# EasyEDA Pro project MicroMouse_v02.eprj, schematic Schematic1

## Sheets
1 Overview: Board Name: Board1; Create Date: 2024-06-04; Page Name: Overview; Project Name: MicroMouse_v01; Schematic Name: Schematic1; Update Date: 2024-10-15; Company: FH-Hagenberg; Drawn: Viktor Hofer; Page Size: A3; Version: V0.1
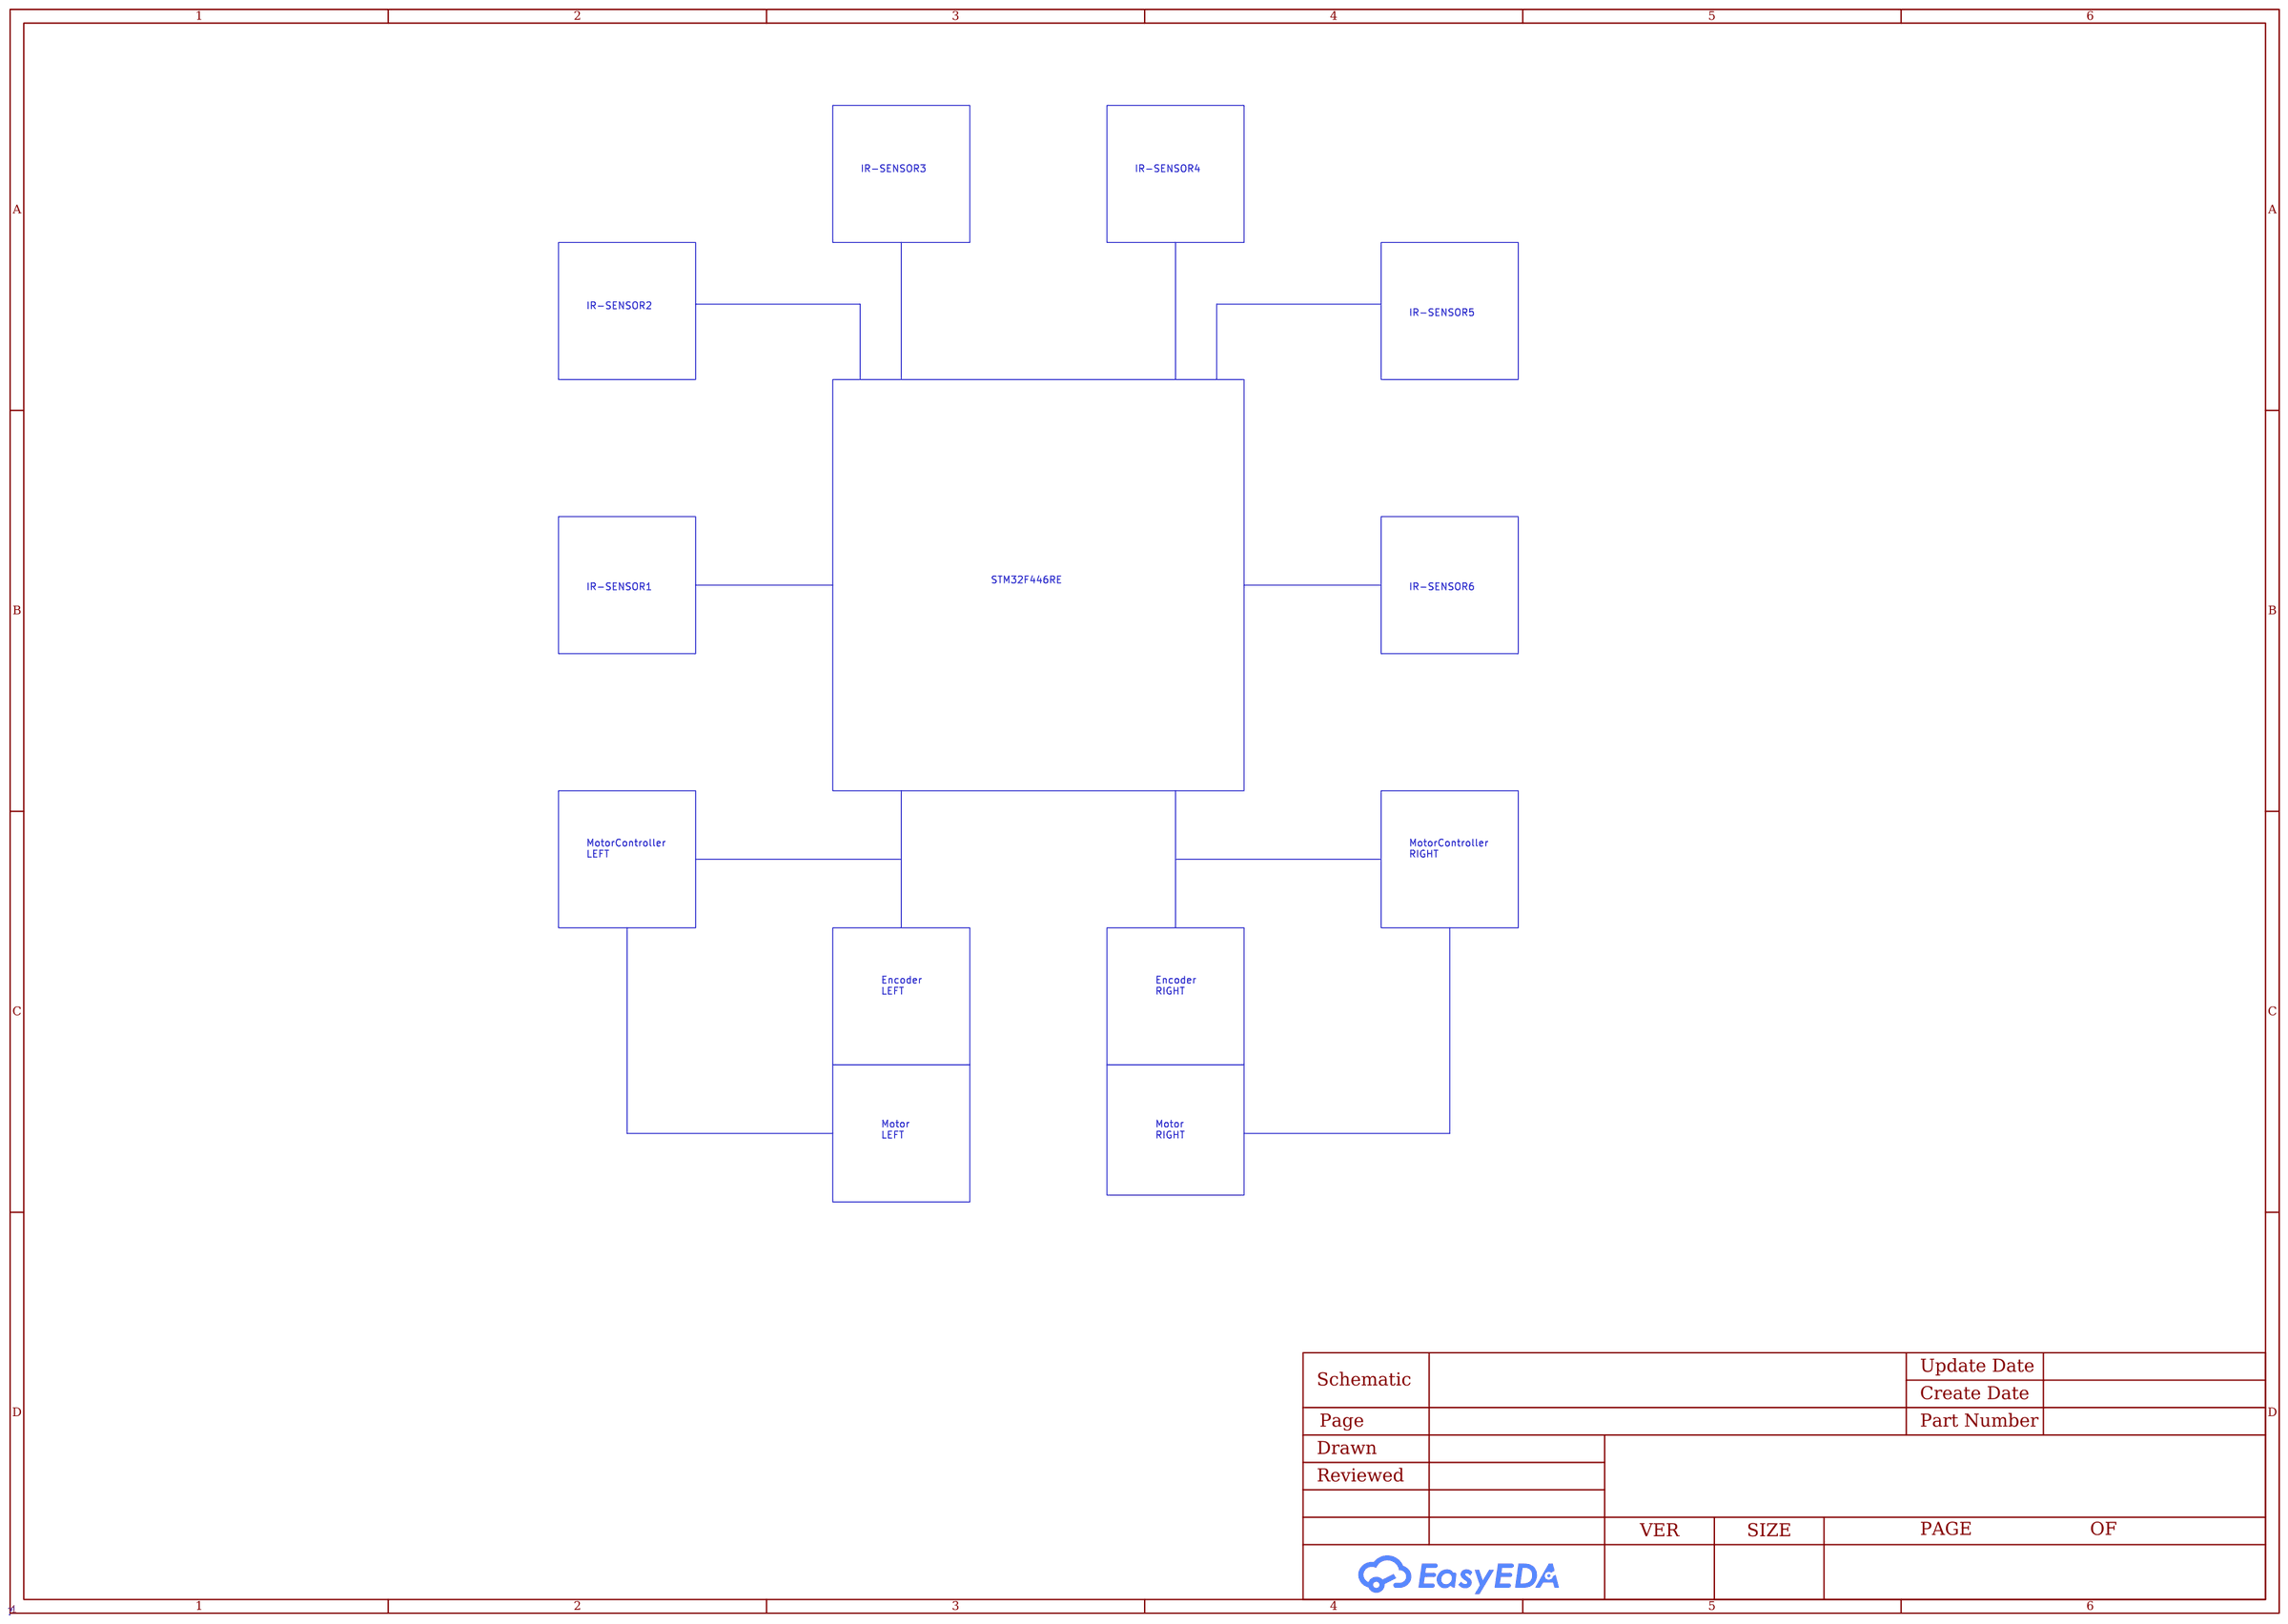
[diagram p0: Overview]
2 VCC: Create Date: 2024-11-02; Page Name: VCC; Project Name: MicroMouse_v02; Update Date: 2024-11-02
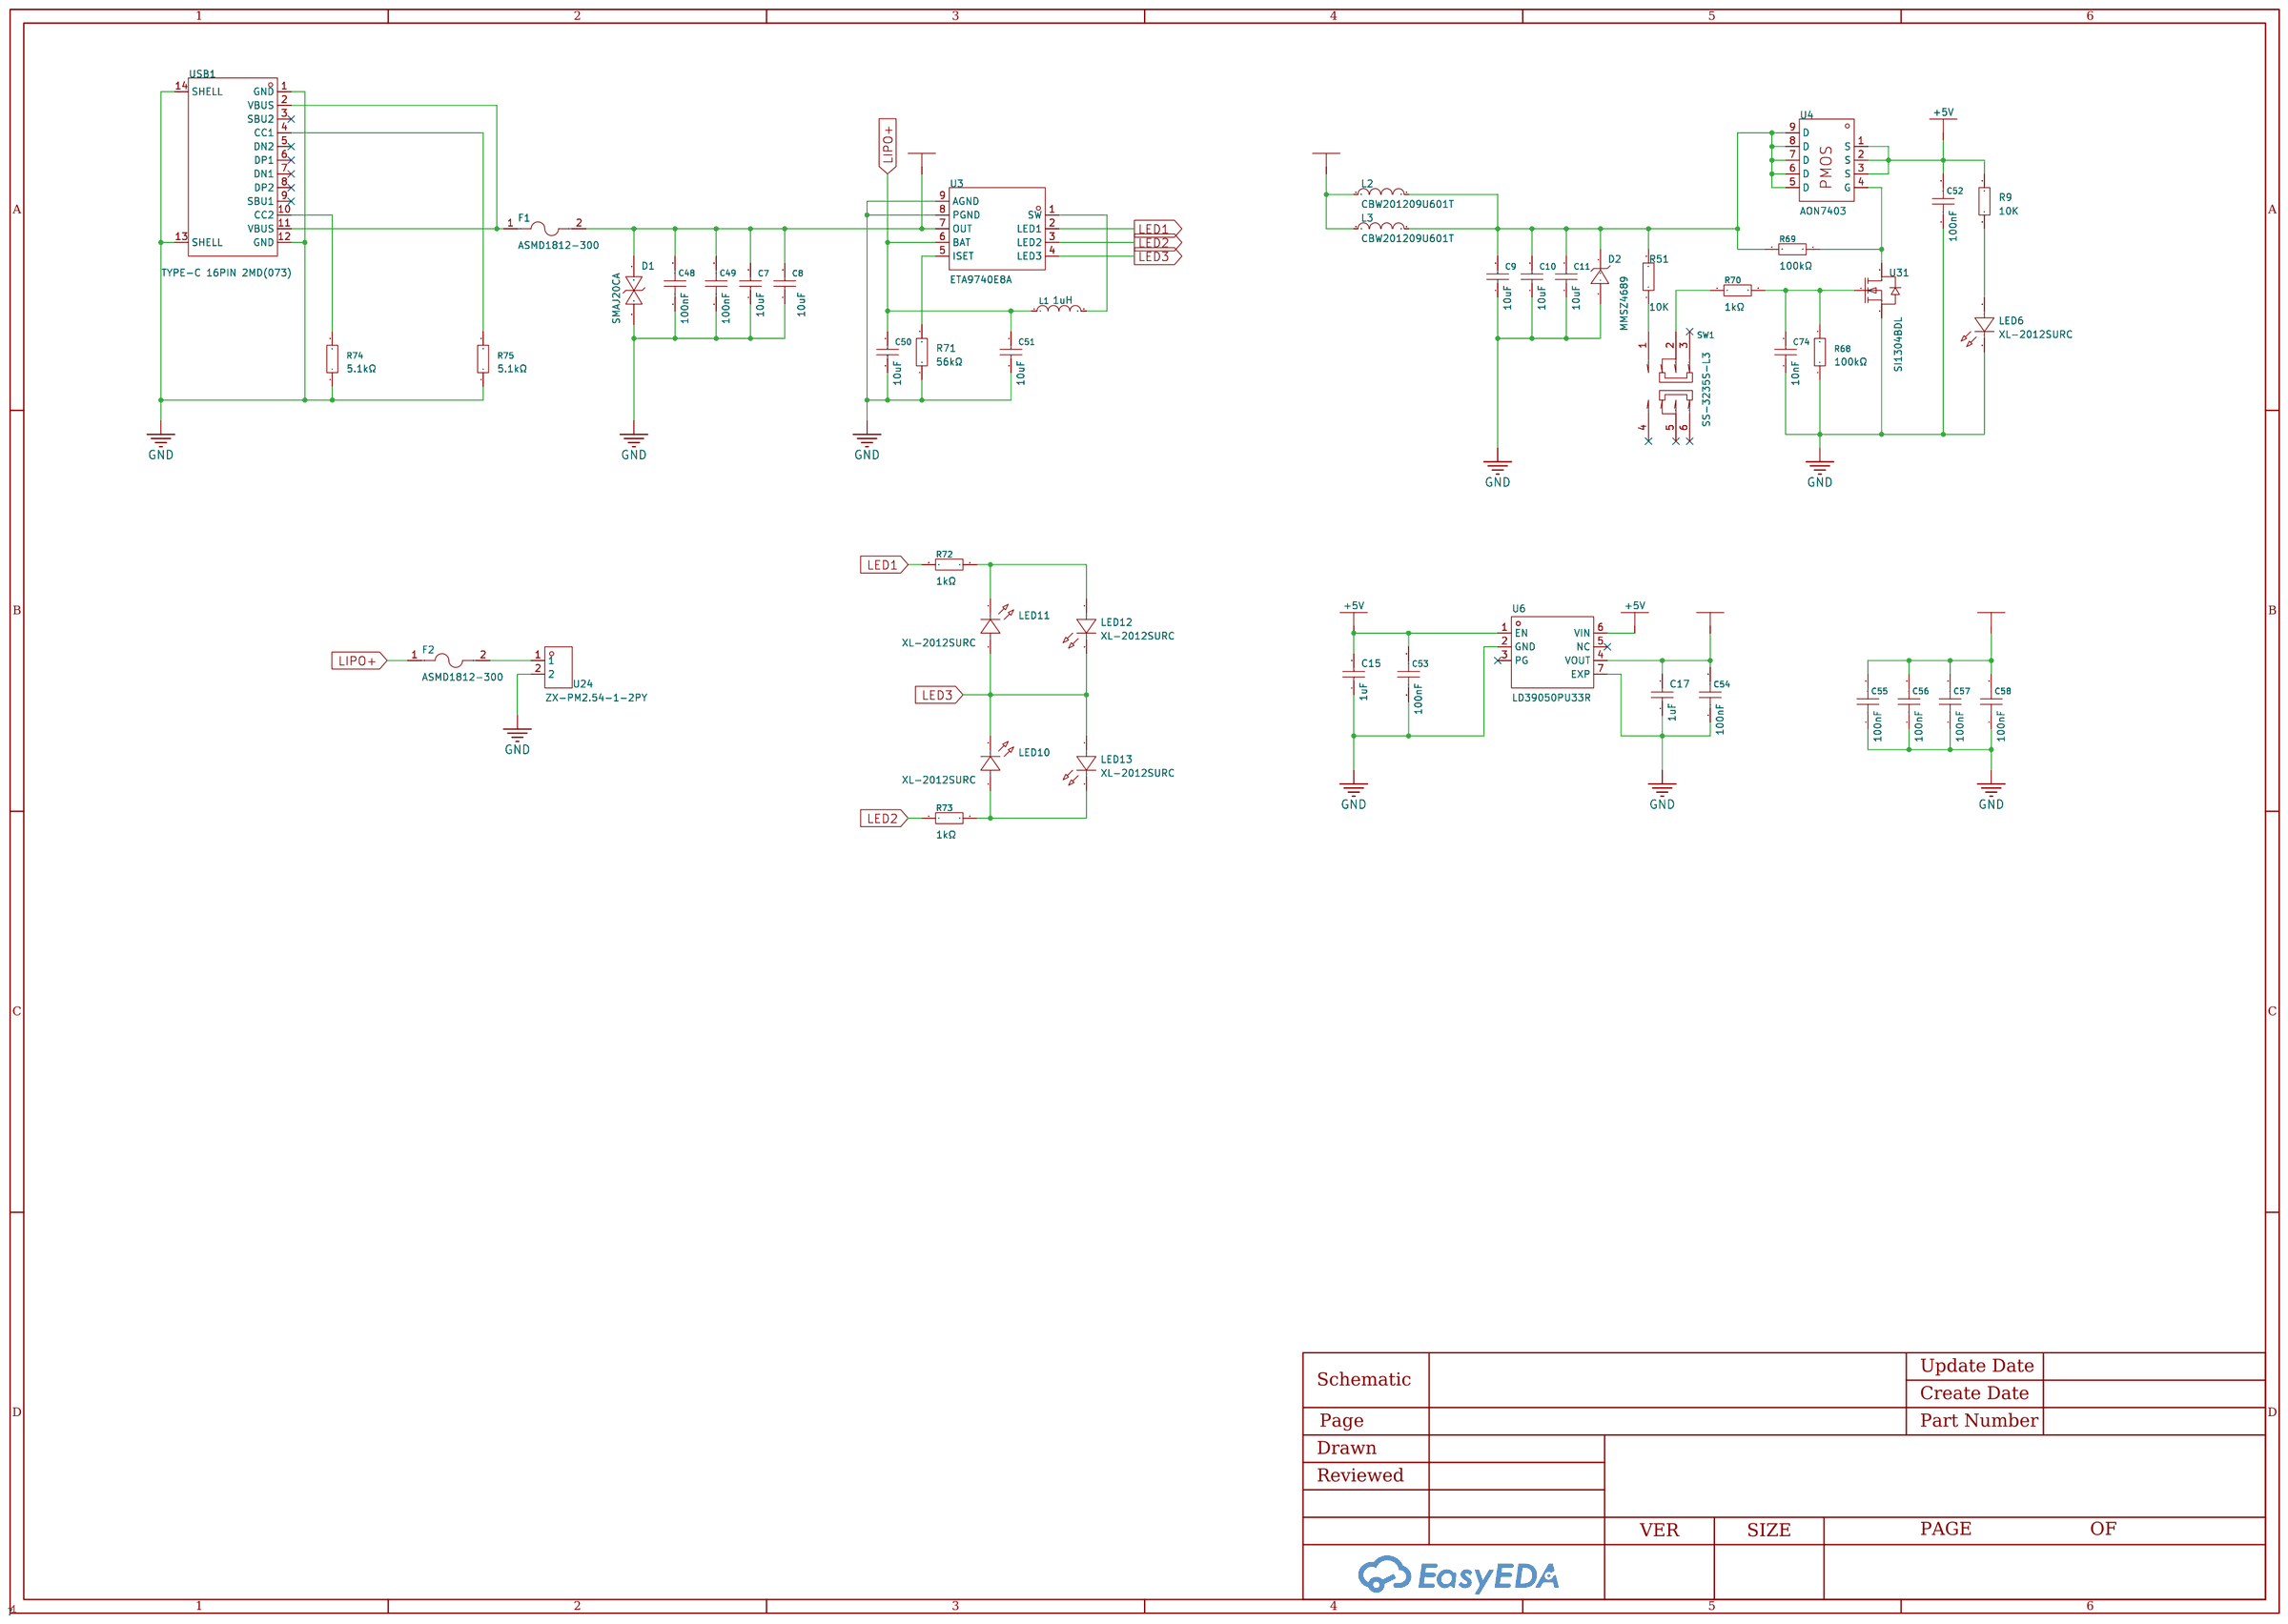
[diagram p1: VCC]
3 Controller: Create Date: 2024-11-02; Page Name: Controller; Project Name: MicroMouse_v02; Update Date: 2024-11-12
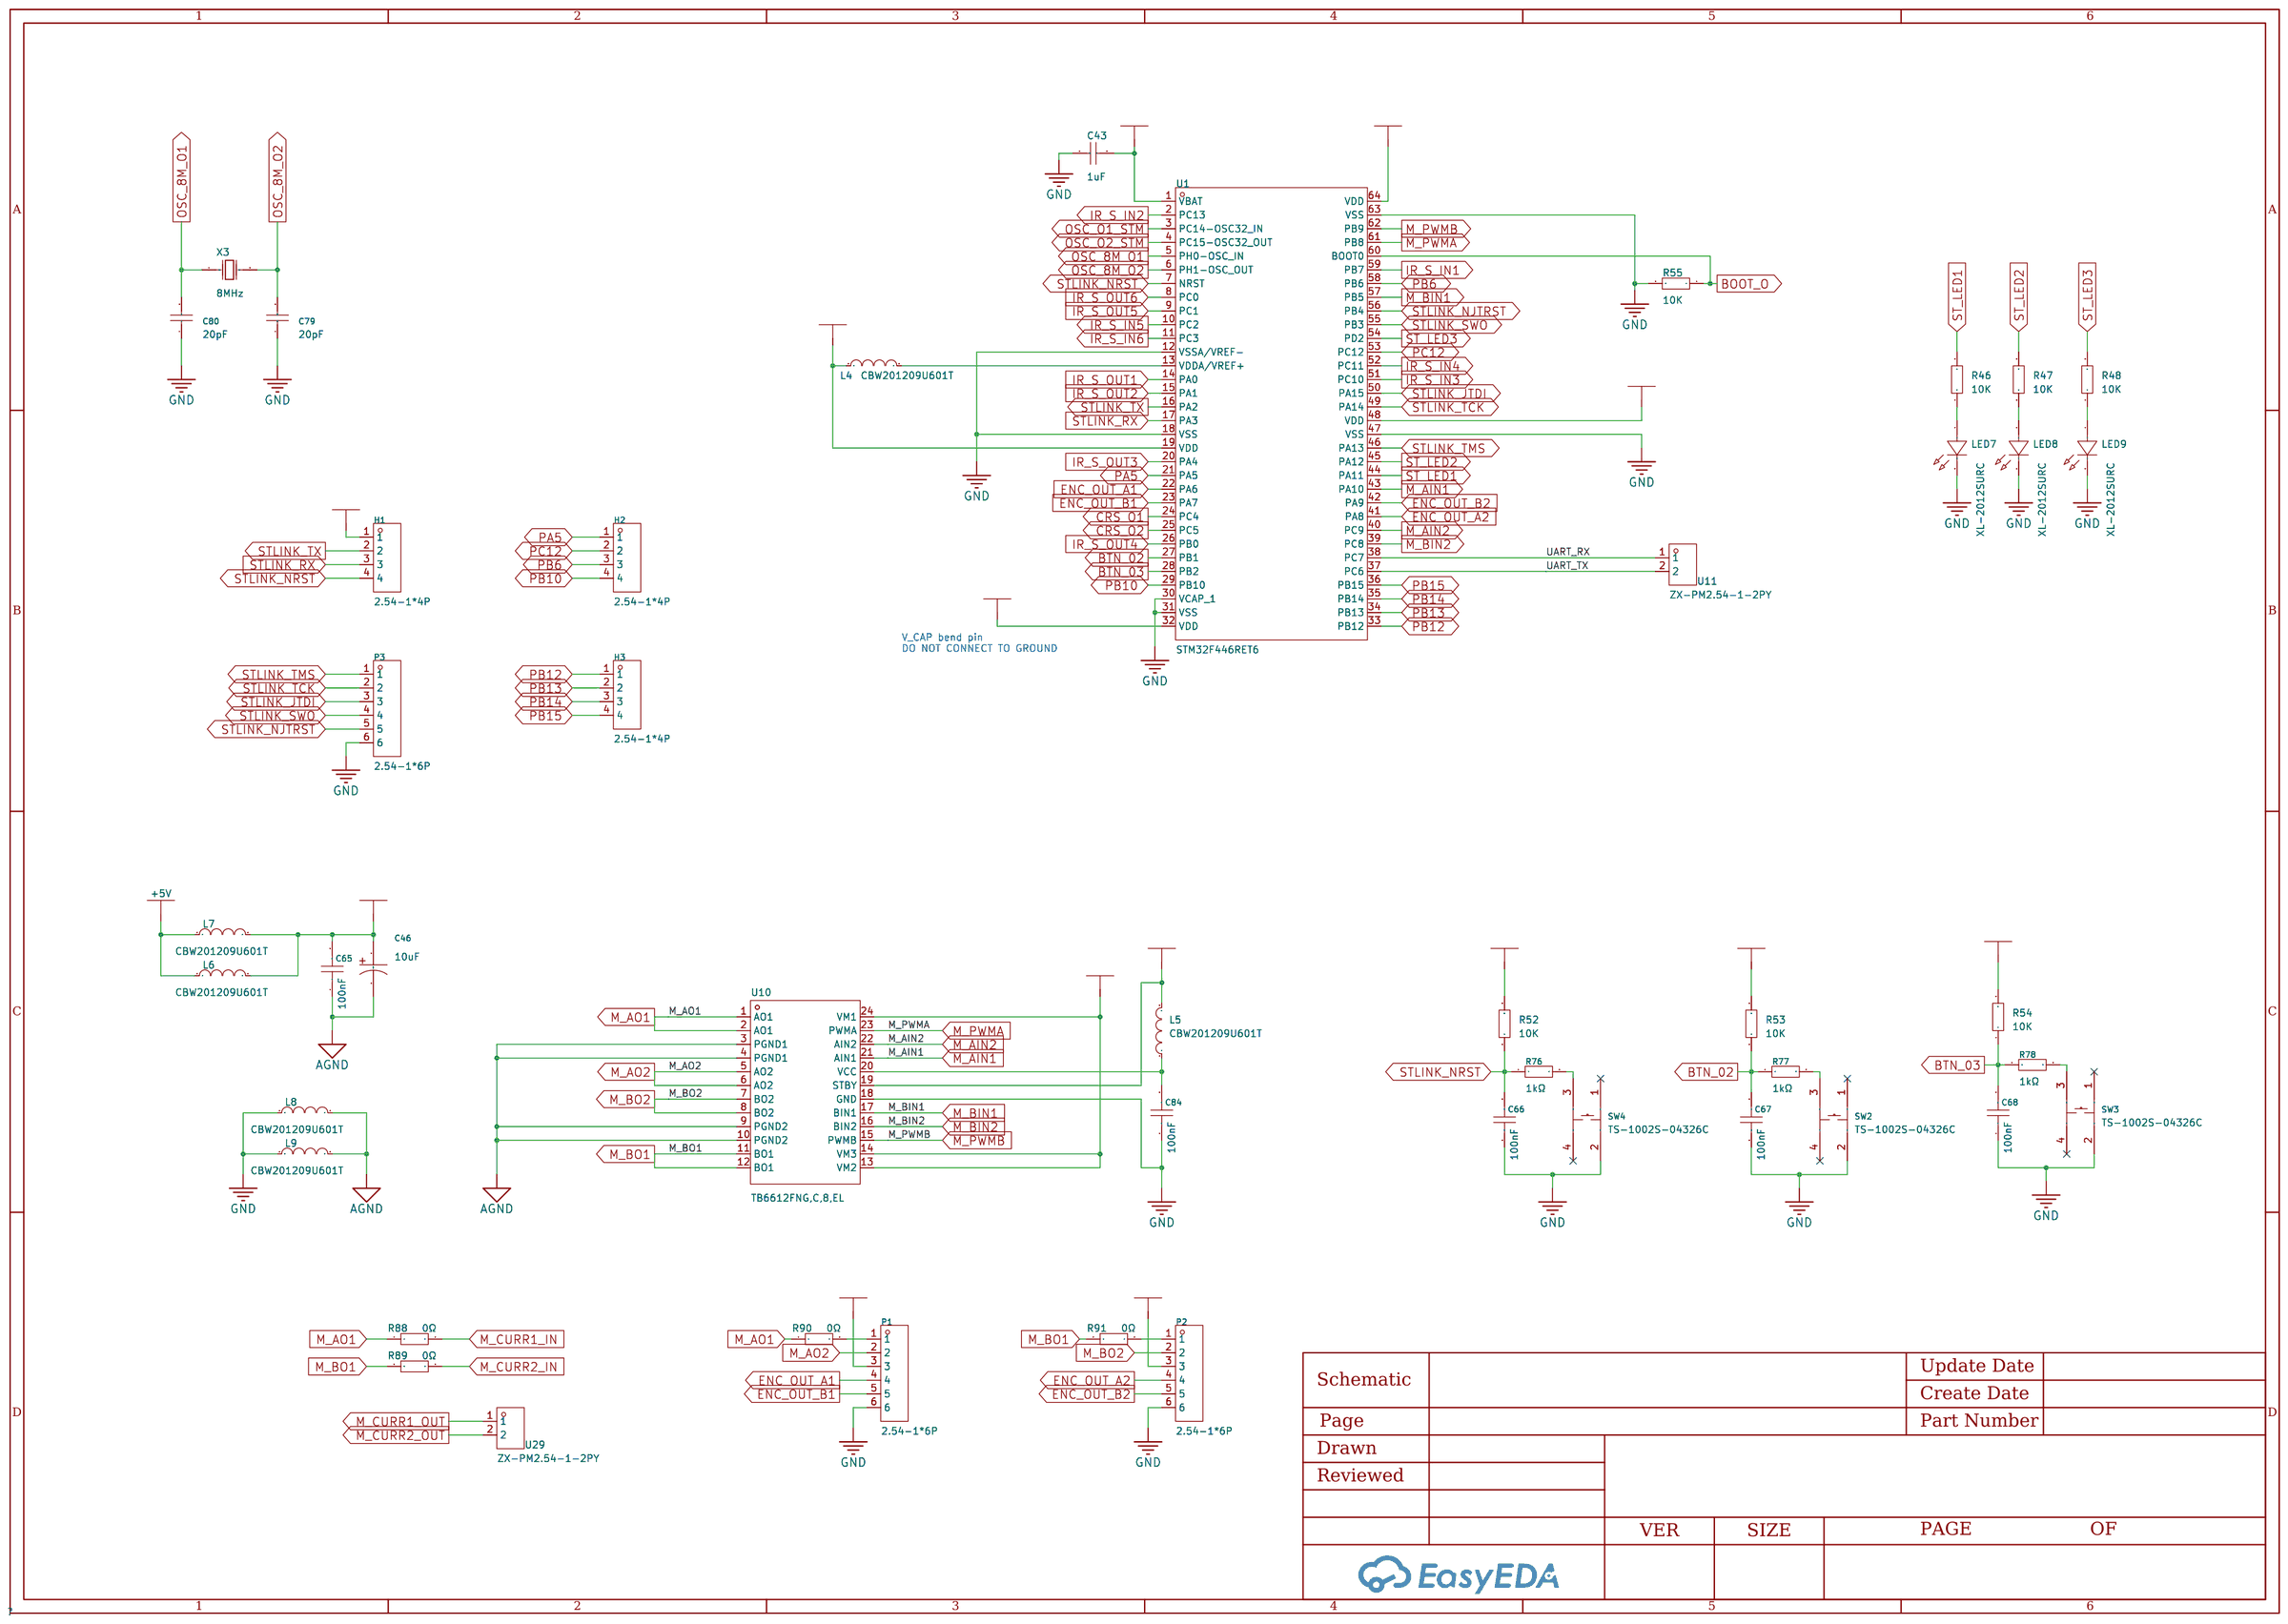
[diagram p2: Controller]
4 Sensors: Create Date: 2024-11-02; Page Name: Sensors; Project Name: MicroMouse_v02; Update Date: 2024-11-02
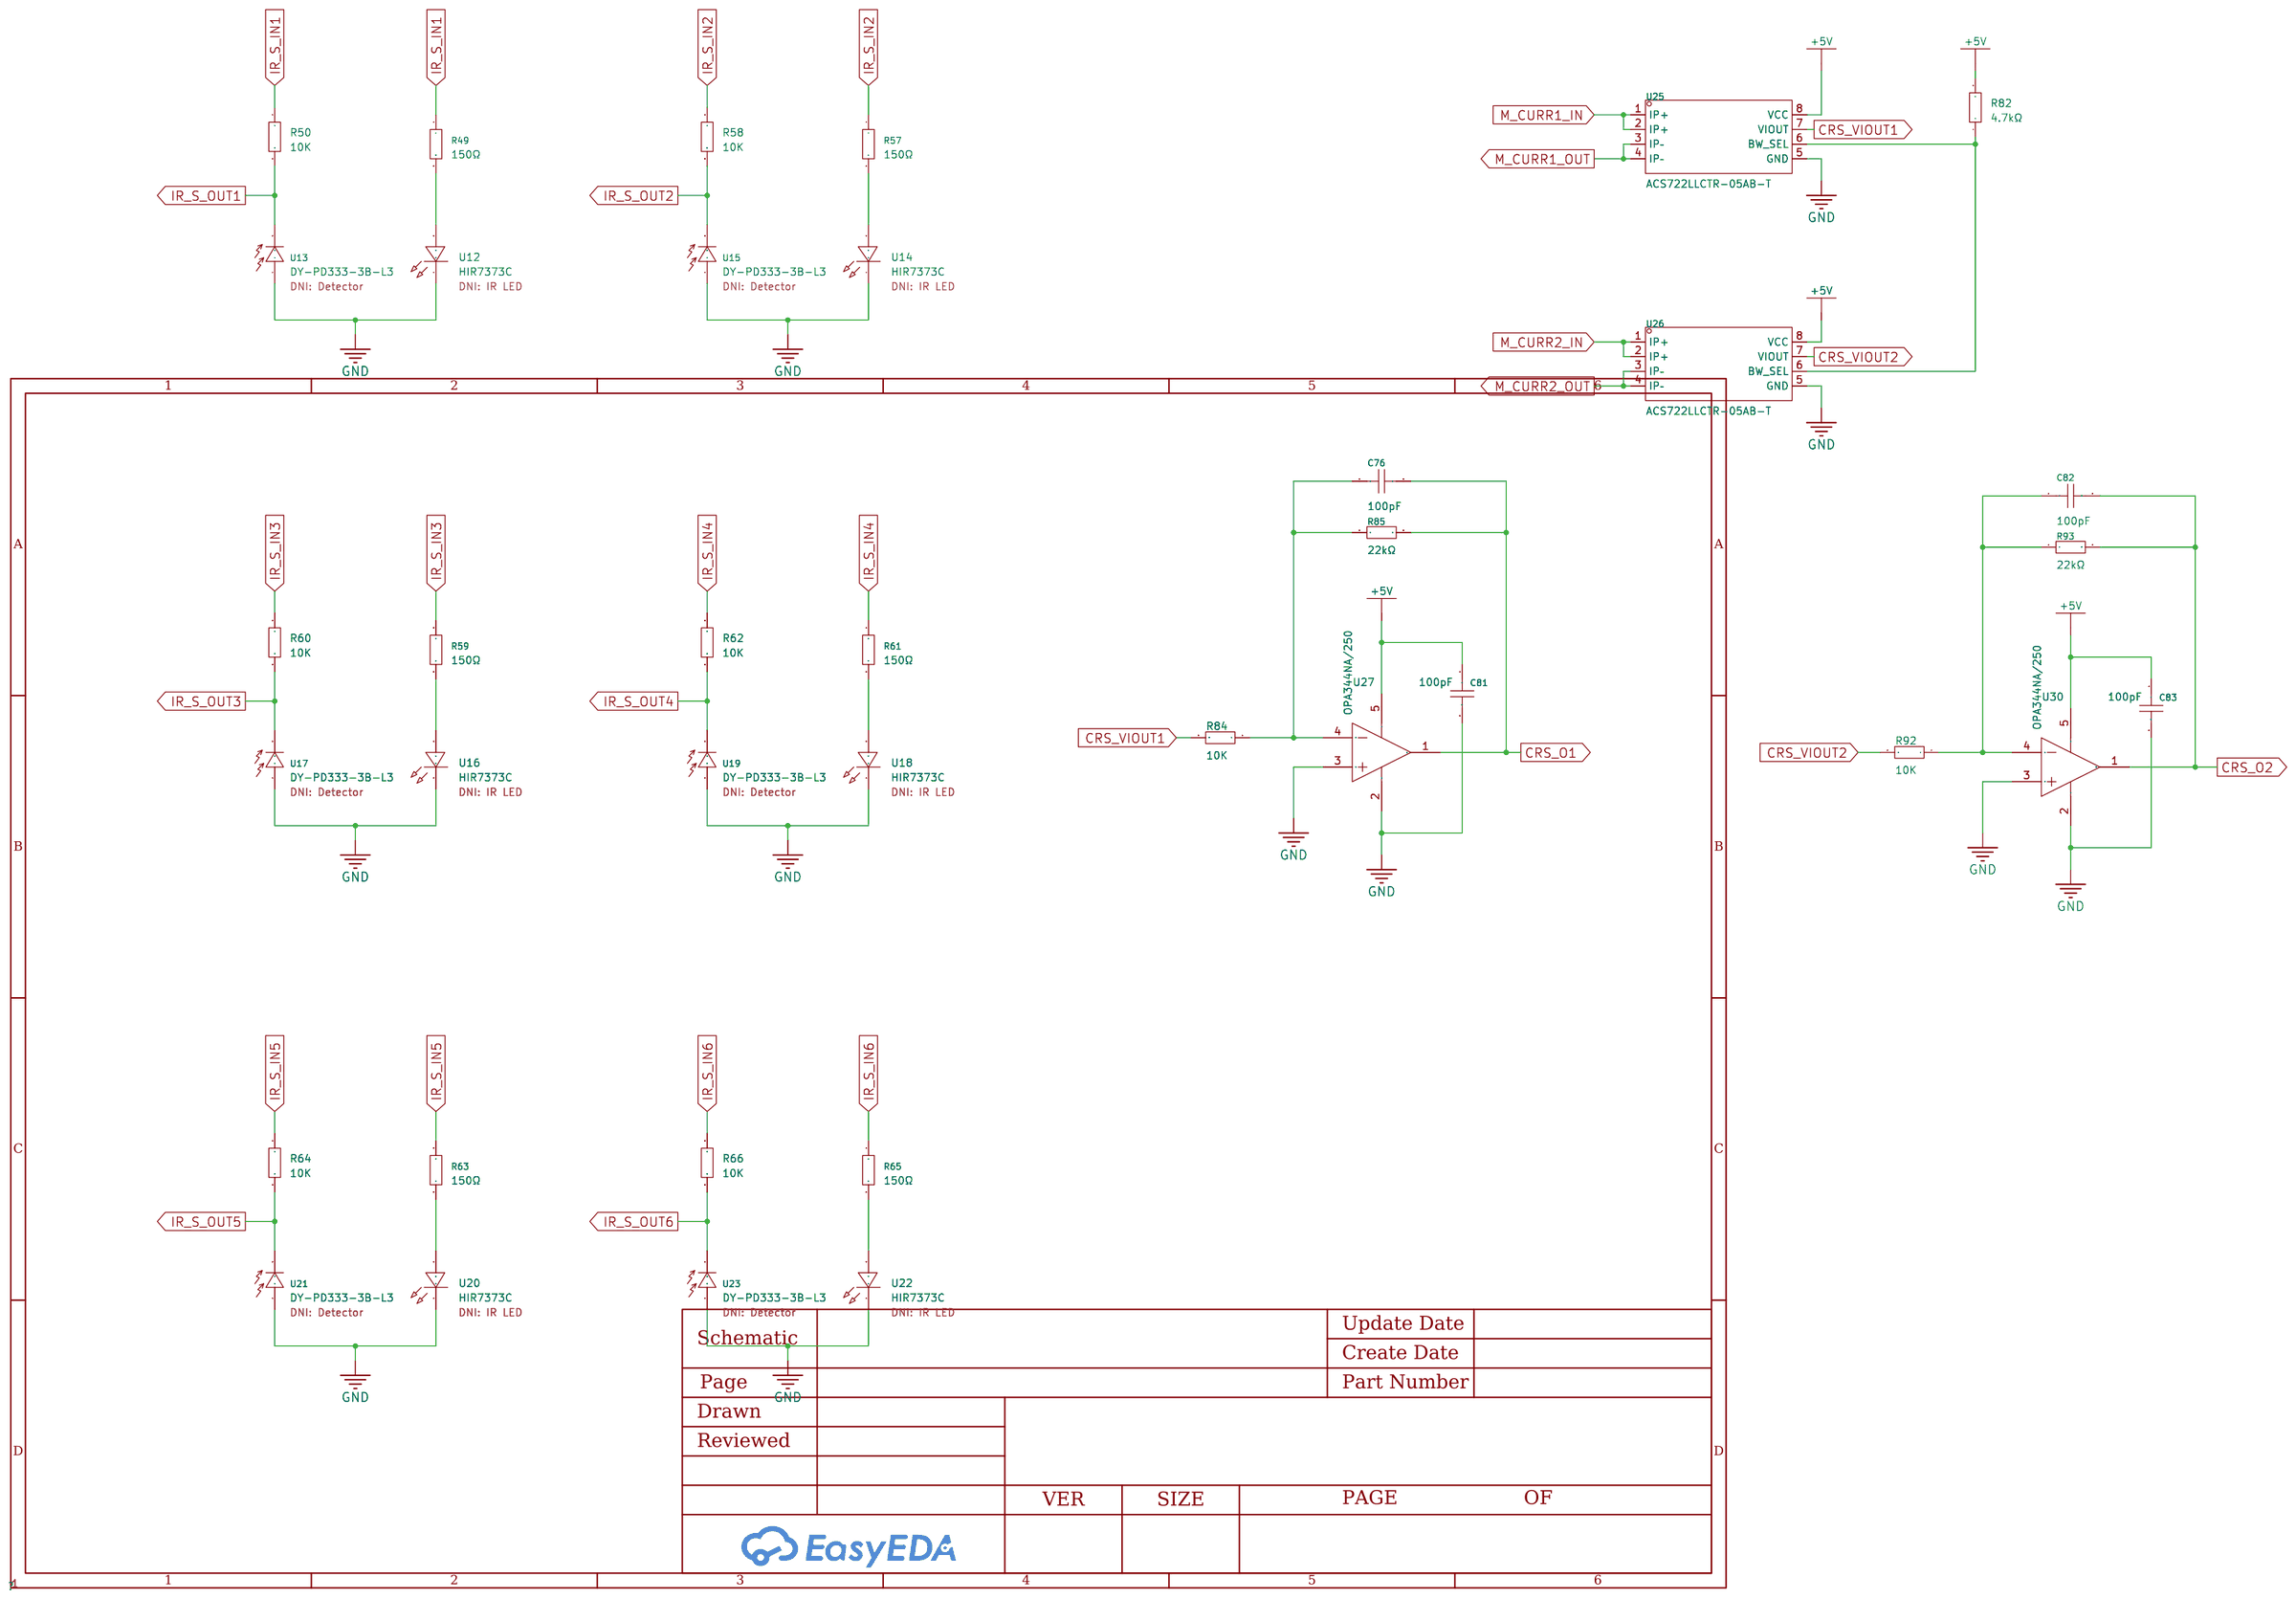
[diagram p3: Sensors]

## Parts
sheet Controller
C43  1uF  [C0603]
C46  10uF  [CAP-TH_BD5.0-P5.00-D1.0-FD]
C65  100nF  [C0603]
C66  100nF  [C0603]
C67  100nF  [C0603]
C68  100nF  [C0603]
C79  20pF  [C0603]
C80  20pF  [C0603]
C84  100nF  [C0603]
H1  2.54-1*4P  [HDR-TH_4P-P2.54-V-F]
H2  2.54-1*4P  [HDR-TH_4P-P2.54-V-F]
H3  2.54-1*4P  [HDR-TH_4P-P2.54-V-F]
L4  CBW201209U601T  [L0805]
L5  CBW201209U601T  [L0805]
L6  CBW201209U601T  [L0805]
L7  CBW201209U601T  [L0805]
L8  CBW201209U601T  [L0805]
L9  CBW201209U601T  [L0805]
LED7  XL-2012SURC  [LED0805-R-RD]
LED8  XL-2012SURC  [LED0805-R-RD]
LED9  XL-2012SURC  [LED0805-R-RD]
P1  2.54-1*6P  [HDR-TH_6P-P2.54-V-F]
P2  2.54-1*6P  [HDR-TH_6P-P2.54-V-F]
P3  2.54-1*6P  [HDR-TH_6P-P2.54-V-F]
R46  10K  [R0603]
R47  10K  [R0603]
R48  10K  [R0603]
R52  10K  [R0603]
R53  10K  [R0603]
R54  10K  [R0603]
R55  10K  [R0603]
R76  1kΩ  [R0603]
R77  1kΩ  [R0603]
R78  1kΩ  [R0603]
R88  0Ω  [R0603]
R89  0Ω  [R0603]
R90  0Ω  [R0603]
R91  0Ω  [R0603]
SW2  TS-1002S-04326C  [KEY-SMD_4P-L6.0-W6.0-P4.50-LS9.0]
SW3  TS-1002S-04326C  [KEY-SMD_4P-L6.0-W6.0-P4.50-LS9.0]
SW4  TS-1002S-04326C  [KEY-SMD_4P-L6.0-W6.0-P4.50-LS9.0]
U1  STM32F446RET6  [LQFP-64_L10.0-W10.0-P0.50-LS12.0-BL]
U10  TB6612FNG,C,8,EL  [SSOP-24_L8.3-W5.6-P0.65-LS7.6-BL]
U11  ZX-PM2.54-1-2PY  [HDR-TH_2P-P2.54-V-F]
U29  ZX-PM2.54-1-2PY  [HDR-TH_2P-P2.54-V-F]
X3  8MHz  [CRYSTAL-SMD_L11.5-W4.8-LS12.7]
sheet Sensors
C76  100pF  [C0603]
C81  100pF  [C0603]
C82  100pF  [C0603]
C83  100pF  [C0603]
R49  150Ω  [R0603]
R50  10K  [R0603]
R57  150Ω  [R0603]
R58  10K  [R0603]
R59  150Ω  [R0603]
R60  10K  [R0603]
R61  150Ω  [R0603]
R62  10K  [R0603]
R63  150Ω  [R0603]
R64  10K  [R0603]
R65  150Ω  [R0603]
R66  10K  [R0603]
R82  4.7kΩ  [R0603]
R84  10K  [R0603]
R85  22kΩ  [R0603]
R92  10K  [R0603]
R93  22kΩ  [R0603]
U12  HIR7373C  [LED-TH_BD5.0-P2.54-L-RD]
U13  DY-PD333-3B-L3  [LED-TH_BD5.0-P2.54-FD]
U14  HIR7373C  [LED-TH_BD5.0-P2.54-L-RD]
U15  DY-PD333-3B-L3  [LED-TH_BD5.0-P2.54-FD]
U16  HIR7373C  [LED-TH_BD5.0-P2.54-L-RD]
U17  DY-PD333-3B-L3  [LED-TH_BD5.0-P2.54-FD]
U18  HIR7373C  [LED-TH_BD5.0-P2.54-L-RD]
U19  DY-PD333-3B-L3  [LED-TH_BD5.0-P2.54-FD]
U20  HIR7373C  [LED-TH_BD5.0-P2.54-L-RD]
U21  DY-PD333-3B-L3  [LED-TH_BD5.0-P2.54-FD]
U22  HIR7373C  [LED-TH_BD5.0-P2.54-L-RD]
U23  DY-PD333-3B-L3  [LED-TH_BD5.0-P2.54-FD]
U25  ACS722LLCTR-05AB-T  [SOIC-8_L4.9-W3.9-P1.27-LS6.0-BL]
U26  ACS722LLCTR-05AB-T  [SOIC-8_L4.9-W3.9-P1.27-LS6.0-BL]
U27  OPA344NA/250  [SOT-23-5_L3.0-W1.7-P0.95-LS2.8-BR]
U30  OPA344NA/250  [SOT-23-5_L3.0-W1.7-P0.95-LS2.8-BR]
sheet VCC
C7  10uF  [C0805]
C8  10uF  [C0805]
C9  10uF  [C0805]
C10  10uF  [C0805]
C11  10uF  [C0805]
C15  1uF  [C0603]
C17  1uF  [C0603]
C48  100nF  [C0603]
C49  100nF  [C0603]
C50  10uF  [C0805]
C51  10uF  [C0805]
C52  100nF  [C0603]
C53  100nF  [C0603]
C54  100nF  [C0603]
C55  100nF  [C0603]
C56  100nF  [C0603]
C57  100nF  [C0603]
C58  100nF  [C0603]
C74  10nF  [C0603]
D1  SMAJ20CA  [SMA_L4.3-W2.6-LS5.2-BI]
D2  MMSZ4689  [SOD-123_L2.8-W1.8-LS3.7-RD]
F1  ASMD1812-300  [F1812]
F2  ASMD1812-300  [F1812]
L1  1uH  [IND-SMD_L7.2-W6.6_GPSR0730]
L2  CBW201209U601T  [L0805]
L3  CBW201209U601T  [L0805]
LED6  XL-2012SURC  [LED0805-R-RD]
LED10  XL-2012SURC  [LED0805-R-RD]
LED11  XL-2012SURC  [LED0805-R-RD]
LED12  XL-2012SURC  [LED0805-R-RD]
LED13  XL-2012SURC  [LED0805-R-RD]
R9  10K  [R0603]
R51  10K  [R0603]
R68  100kΩ  [R0603]
R69  100kΩ  [R0603]
R70  1kΩ  [R0603]
R71  56kΩ  [R0603]
R72  1kΩ  [R0603]
R73  1kΩ  [R0603]
R74  5.1kΩ  [R0603]
R75  5.1kΩ  [R0603]
SW1  SS-3235S-L3  [SW-SMD_SS-3235S-L3.00]
U3  ETA9740E8A  [ESOP-8_L4.9-W3.9-P1.27-LS6.0-BL-EP-1]
U4  AON7403  [DFN-8_L3.0-W3.0-P0.65-BL]
U6  LD39050PU33R  [DFN-6_L3.0-W3.0-P0.95-LS3.1-TL-EP]
U24  ZX-PM2.54-1-2PY  [HDR-TH_2P-P2.54-V-F]
U31  SI1304BDL  [SOT-323-3_L2.0-W1.3-P1.30-LS2.1-BL]
USB1  TYPE-C 16PIN 2MD(073)  [USB-C-SMD_TYPE-C-6PIN-2MD-073]

## Library data of the parts
C15 C17 C43 = CL10A105KO8NNNC: Capacitance: Tolerance:±10% Tolerance:±10% Voltage Rated: Temperature Coefficient:; LCSC Part Name: 1uF ±10% 16V; Supplier Part: C1592; Manufacturer: SAMSUNG(三星); Supplier Footprint: 0603; JLCPCB Part Class: Extended Part; Datasheet: https://atta.szlcsc.com/upload/public/pdf/source/20220919/9FBE606BE0D9532D730F292EB26DC5BB.pdf; Supplier: LCSC; Tolerance: ±10%
C46 = UVZ1C100MDD1TA: Capacitance: Tolerance:±20% Tolerance:±20% Rated Voltage: Ripple Current:35mA@120Hz Equivalent Series Resistance(ESR):- Lead Spacing:2mm φD: L: Lifetime @ Temp:1000hrs@105℃ Operating Temperature:-55℃~+105℃ Operating Temperature:-55℃~+105℃; LCSC Part Name: 10uF ±20% 16V; Supplier Part: C250876; Manufacturer: Nichicon(尼吉康); Supplier Footprint: 插件,D5xL11mm; JLCPCB Part Class: Extended Part; Datasheet: https://atta.szlcsc.com/upload/public/pdf/source/20180925/C308870_1835EFB626D2D8CF3B207CFFD6F8F272.pdf; Supplier: LCSC; Tolerance: ±20%; Ripple Current: 35mA@120Hz; Lead Spacing: 2mm; Lifetime @ Temp: 1000hrs@105℃; Operating Temperature: -55℃~+105℃
C48 C49 C52-C58 C65-C68 C84 = CC0603KRX7R6BB104: Capacitance: Tolerance:±10% Tolerance:±10% Voltage Rated: Temperature Coefficient:; LCSC Part Name: 100nF ±10% 10V; Supplier Part: C519438; Manufacturer: YAGEO(国巨); Supplier Footprint: 0603; JLCPCB Part Class: Extended Part; Datasheet: https://atta.szlcsc.com/upload/public/pdf/source/20200423/C519438_5D8E3909BA347820A92655F61B0D4FC7.pdf; Supplier: LCSC; Tolerance: ±10%
C79 C80 = CC0603JRNPO9BN200: Capacitance: Tolerance:±5% Tolerance:±5% Voltage Rated: Temperature Coefficient:; LCSC Part Name: 20pF ±5% 50V; Supplier Part: C105621; Manufacturer: YAGEO(国巨); Supplier Footprint: 0603; JLCPCB Part Class: Extended Part; Datasheet: https://atta.szlcsc.com/upload/public/pdf/source/20170505/1493957838062.pdf; Supplier: LCSC; Tolerance: ±5%
H1-H3 = 2.54-1*4P母: Holes Structure:1x4P Pitch:2.54mm Row Spacing:- Circular Hole / Square Hole:Square Holes Mounting Type:Straight Number of Rows:Plugin Number of Holes:4P Current Rating (Max):3A Voltage Rating (Max):- Holes Direction:Top Insulation Height:- Contact Materia; LCSC Part Name: 间距:2.54mm 1x4P 直插; Supplier Part: C2718488; Manufacturer: BOOMELE(博穆精密); Supplier Footprint: 插件,P=2.54mm; JLCPCB Part Class: Extended Part; Datasheet: https://atta.szlcsc.com/upload/public/pdf/source/20210301/C2718488_F4427B881E42CAA8DDB0B1C12B3A522C.pdf; Supplier: LCSC; Holes Structure: 1x4P; Pitch: 2.54mm; Circular Hole / Square Hole: Square Holes; Mounting Type: Straight; Number of Rows: Plugin; Number of Holes: 4P; Current Rating (Max): 3A; Holes Direction: Top; Contact Material: bronze; Operating Temperature Range: -40℃~+105℃
L2-L9 = CBW201209U601T: Impedance @ Frequency:600Ω@100MHz Tolerance:±25% Tolerance:±25% DC Resistance:250mΩ Current Rating:1.5A Circuits:1; LCSC Part Name: 单路 0805磁珠 阻抗600Ω@100MHz; Supplier Part: C21286; Manufacturer: FH(风华); Supplier Footprint: 0805; JLCPCB Part Class: Extended Part; Datasheet: https://atta.szlcsc.com/upload/public/pdf/source/20190129/C361676_507080CDC8DBC2B0B7C2139C1873642D.pdf; Supplier: LCSC; Impedance @ Frequency: 600Ω@100MHz; Tolerance: ±25%; DC Resistance: 250mΩ; Current Rating: 1.5A; Circuits: 1
LED6-LED13 = XL-2012SURC: Emitted Color:Red Power Dissipation:55mW Forward Current:25mA Dominant Wavelength:617nm~621nm Dominant Wavelength:617nm~621nm Peak Wavelength:623nm Lens Color:无色透明透镜 Color Temperature:- Color Temperature:- Viewing Angle:120° Mounting Sytle:Positive post O; Supplier Part: C965812; Manufacturer: XINGLIGHT(成兴光); Supplier Footprint: 0805; JLCPCB Part Class: Extended Part; Datasheet: https://atta.szlcsc.com/upload/public/pdf/source/20221102/49E1A0A365644091E6270AF1C5E0FE37.pdf; Supplier: LCSC; Emitted Color: Red; Power Dissipation: 55mW; Forward Current: 25mA; Dominant Wavelength: 617nm~621nm; Peak Wavelength: 623nm; Lens Color: 无色透明透镜; Viewing Angle: 120°; Mounting Sytle: Positive post; Operating Temperature: -30℃~+85℃
P1-P3 = 2.54-1*6P母: Holes Structure:1x6P Pitch:2.54mm Row Spacing:- Mounting Type:Straight Number of Rows:Plugin Number of Holes:6P Insulation Height:- Contact Material:- Contact Plating:-; LCSC Part Name: 间距:2.54mm 1x6P 直插; Supplier Part: C40877; Manufacturer: BOOMELE(博穆精密); Supplier Footprint: 插件,P=2.54mm; JLCPCB Part Class: Extended Part; Datasheet: https://atta.szlcsc.com/upload/public/pdf/source/20210301/C2718488_F4427B881E42CAA8DDB0B1C12B3A522C.pdf; Supplier: LCSC; Holes Structure: 1x6P; Pitch: 2.54mm; Mounting Type: Straight; Number of Rows: Plugin; Number of Holes: 6P
R9 R46-R48 R50-R55 R58 R60 R62 R64 R66 R84 R92 = Res_0603: DNI; Supplier Footprint: 0603
R70 R72 R73 R76-R78 = 0603WAF1001T5E: Type:Thick Film Resistors Resistance:1kΩ Tolerance:±1% Tolerance:±1% Power(Watts): Overload Voltage (Max): Temperature Coefficient:±100ppm/℃ Temperature Coefficient:±100ppm/℃ Operating Temperature Range:-55℃~+155℃ Operating Temperature Range:-55℃~+155℃; LCSC Part Name: 1kΩ ±1% 100mW 厚膜电阻; Supplier Part: C21190; Manufacturer: UNI-ROYAL(厚声); Supplier Footprint: 0603; JLCPCB Part Class: Basic Part; Datasheet: https://atta.szlcsc.com/upload/public/pdf/source/20200306/C422600_1E6D84923E4A46A82E41ADD87F860B5C.pdf; Supplier: LCSC; Type: Thick Film Resistors; Tolerance: ±1%; Temperature Coefficient: ±100ppm/℃; Operating Temperature Range: -55℃~+155℃
R88-R91 = 0603WAF0000T5E: Type:Thick Film Resistors Resistance: Tolerance:±1% Tolerance:±1% Power(Watts): Overload Voltage (Max): Operating Temperature Range:-55℃~+155℃ Operating Temperature Range:-55℃~+155℃; LCSC Part Name: 0Ω ±1% 100mW 厚膜电阻; Supplier Part: C21189; Manufacturer: UNI-ROYAL(厚声); Supplier Footprint: 0603; JLCPCB Part Class: Basic Part; Datasheet: https://atta.szlcsc.com/upload/public/pdf/source/20200306/C422600_1E6D84923E4A46A82E41ADD87F860B5C.pdf; Supplier: LCSC; Type: Thick Film Resistors; Tolerance: ±1%; Operating Temperature Range: -55℃~+155℃
SW2-SW4 = TS-1002S-04326C: Circuit:SPST Actuator Style:Round Button Mounting Style:Brick nogging Switch Length:6mm Switch Width:6mm Switch Height:4.3mm Contact Current:50mA Voltage Rating (DC):12V With Lamp:- Mechanical Life:-; LCSC Part Name: 6*6*4.3mm 立贴 轻触开关; Supplier Part: C455108; Manufacturer: XUNPU(讯普); Supplier Footprint: SMD,6x6mm; JLCPCB Part Class: Extended Part; Datasheet: https://atta.szlcsc.com/upload/public/pdf/source/20191118/C455126_F61E8FA1ED640FB1CE0B30B55DEB62E3.pdf; Supplier: LCSC; Circuit: SPST; Actuator Style: Round Button; Mounting Style: Brick nogging; Switch Length: 6mm; Switch Width: 6mm; Switch Height: 4.3mm; Contact Current: 50mA; Voltage Rating (DC): 12V
U1 = STM32F446RET6: CPU Core:CM4 Program Storage Size:512KB RAM Size:128KB GPIO Ports Number:50 Operating Voltage Range:1.7V~3.6V Operating Voltage Range:1.7V~3.6V CPU Maximum Speed:180MHz Program Memory Type:FLASH Operating Temperature Range:-40℃~+85℃ Operating Temperature; LCSC Part Name: STM32F446RET6 MSL=3; Supplier Part: C69336; Manufacturer: ST(意法半导体); Supplier Footprint: LQFP-64(10x10); JLCPCB Part Class: Extended Part; Datasheet: https://atta.szlcsc.com/upload/public/pdf/source/20170518/1495086068896.pdf; Supplier: LCSC; CPU Core: CM4; Program Storage Size: 512KB; RAM Size: 128KB; GPIO Ports Number: 50; Operating Voltage Range: 1.7V~3.6V; CPU Maximum Speed: 180MHz; Program Memory Type: FLASH; Operating Temperature Range: -40℃~+85℃; ADC (Bit): 12bit; DAC (Bit): 12bit; Universal Serial Bus: 有; Peripheral/Function: PWM；PWM；Low-Voltage检测; Watchdog: 有; Infrared Data Association: 有; Low-Voltage Detect: 有; Direct Memory Access: 有; Internal Oscillator: 有
U10 = TB6612FNG,C,8,EL: LCSC Part Name: 1A 有刷直流电机驱动芯片 5.5V; Supplier Part: C141517; Manufacturer: TOSHIBA(东芝); Supplier Footprint: SSOP-24; JLCPCB Part Class: Extended Part; Datasheet: https://atta.szlcsc.com/upload/public/pdf/source/20171128/C141517_15118625624231147036.pdf; Supplier: LCSC
U11 U24 U29 = ZX-PM2.54-1-2PY: Holes Structure:1x2P Pitch:2.54mm Row Spacing:- Circular Hole / Square Hole:Square Hole Mounting Type:Direct Insert Number of Rows:Single Row Number of Holes:2P Current Rating (Max):- Voltage Rating (Max):1kV Holes Direction:Top Insulation Height:8.5mm Co; LCSC Part Name: 1x2P 间距:2.54mm 直插; Supplier Part: C7499322; Manufacturer: Megastar(兆星); Supplier Footprint: 插件,P=2.54mm; JLCPCB Part Class: Extended Part; Datasheet: https://atta.szlcsc.com/upload/public/pdf/source/20231122/F22175ABE3DCBFEB9E36A2E7DA44623C.pdf; Supplier: LCSC; Holes Structure: 1x2P; Pitch: 2.54mm; Circular Hole / Square Hole: Square Hole; Mounting Type: Direct Insert; Number of Rows: Single Row; Number of Holes: 2P; Voltage Rating (Max): 1kV; Holes Direction: Top; Insulation Height: 8.5mm; Contact Plating: Gold; Operating Temperature Range: -40℃~+105℃; Soldering Temperature(Max): 260℃@5S
X3 = X49SM8MSD2SC: Crystal Type:Surface Mount Crystal Frequency: Normal temperature Frequency Tolerance:±20ppm Normal temperature Frequency Tolerance:±20ppm External load capacitor: Frequency Stability(Full temperature range):±30ppm Frequency Stability(Full temperature rang; LCSC Part Name: 8MHz ±20ppm 20pF; Supplier Part: C12674; Manufacturer: YXC(扬兴晶振); Supplier Footprint: HC-49S-SMD; JLCPCB Part Class: Basic Part; Datasheet: https://atta.szlcsc.com/upload/public/pdf/source/20240329/3EBF42EBCAB50CA65B6FA9D7CFA1955A.pdf; Supplier: LCSC; Crystal Type: Surface Mount Crystal; Normal temperature Frequency Tolerance: ±20ppm; Frequency Stability(Full temperature range): ±30ppm
C76 C81-C83 = CC0603JRNPO9BN101: Capacitance: Tolerance:±5% Tolerance:±5% Voltage Rated: Temperature Coefficient:; LCSC Part Name: 100pF ±5% 50V; Supplier Part: C14665; Manufacturer: YAGEO(国巨); Supplier Footprint: 0603; JLCPCB Part Class: Extended Part; Datasheet: https://atta.szlcsc.com/upload/public/pdf/source/20181008/C309499_21CC21451B82C39E3D92150FD6B30293.pdf; Supplier: LCSC; Tolerance: ±5%
R49 R57 R59 R61 R63 R65 = 0603WAF1500T5E: Type:Thick Film Resistors Resistance: Tolerance:±1% Tolerance:±1% Power(Watts): Overload Voltage (Max): Temperature Coefficient:±100ppm/℃ Temperature Coefficient:±100ppm/℃ Operating Temperature Range:-55℃~+155℃ Operating Temperature Range:-55℃~+155℃; LCSC Part Name: 150Ω ±1% 100mW 厚膜电阻; Supplier Part: C22808; Manufacturer: UNI-ROYAL(厚声); Supplier Footprint: 0603; JLCPCB Part Class: Basic Part; Datasheet: https://atta.szlcsc.com/upload/public/pdf/source/20200306/C422600_1E6D84923E4A46A82E41ADD87F860B5C.pdf; Supplier: LCSC; Type: Thick Film Resistors; Tolerance: ±1%; Temperature Coefficient: ±100ppm/℃; Operating Temperature Range: -55℃~+155℃
R82 = RC0603FR-074K7L: Type:Thick Film Resistors Resistance: Tolerance:±1% Tolerance:±1% Power(Watts): Overload Voltage (Max): Temperature Coefficient:±100ppm/℃ Temperature Coefficient:±100ppm/℃ Operating Temperature Range:-55℃~+155℃ Operating Temperature Range:-55℃~+155℃; LCSC Part Name: 厚膜电阻 4.7kΩ ±1% 100mW; Supplier Part: C99782; Manufacturer: YAGEO(国巨); Supplier Footprint: 0603; JLCPCB Part Class: Extended Part; Datasheet: https://atta.szlcsc.com/upload/public/pdf/source/20180224/C181757_15194369480721363983.pdf; Supplier: LCSC; Type: Thick Film Resistors; Tolerance: ±1%; Temperature Coefficient: ±100ppm/℃; Operating Temperature Range: -55℃~+155℃
R85 R93 = 0603WAF2202T5E: Type:Thick Film Resistors Resistance:22kΩ Tolerance:±1% Tolerance:±1% Power(Watts): Overload Voltage (Max): Temperature Coefficient:±100ppm/℃ Temperature Coefficient:±100ppm/℃ Operating Temperature Range:-55℃~+155℃ Operating Temperature Range:-55℃~+155℃; LCSC Part Name: 22kΩ ±1% 100mW 厚膜电阻; Supplier Part: C31850; Manufacturer: UNI-ROYAL(厚声); Supplier Footprint: 0603; JLCPCB Part Class: Basic Part; Datasheet: https://atta.szlcsc.com/upload/public/pdf/source/20200306/C422600_1E6D84923E4A46A82E41ADD87F860B5C.pdf; Supplier: LCSC; Type: Thick Film Resistors; Tolerance: ±1%; Temperature Coefficient: ±100ppm/℃; Operating Temperature Range: -55℃~+155℃
U12 U14 U16 U18 U20 U22 = HIR7373C: Vf - Forward Voltage:1.45V~1.65V Vf - Forward Voltage:1.45V~1.65V Power Dissipation:150mW Wavelength:850nm Wavelength:850nm Radiant Intensity: Current - DC Forward (If):20mA Reverse Voltage:- View Angle:40° Operating Temperature:-40℃~+85℃ Operating Temper; Supplier Part: C264285; Manufacturer: EVERLIGHT(亿光); Supplier Footprint: 插件,D=5.1mm; JLCPCB Part Class: Extended Part; Datasheet: https://atta.szlcsc.com/upload/public/pdf/source/20230425/3A7B42B47ADAEE3D8A2D6D40138B00CA.pdf; Supplier: LCSC; Vf - Forward Voltage: 1.45V~1.65V; Power Dissipation: 150mW; Wavelength: 850nm; Current - DC Forward (If): 20mA; View Angle: 40°; Operating Temperature: -40℃~+85℃; DNI: IR LED
U13 U15 U17 U19 U21 U23 = DY-PD333-3B-L3: LCSC Part Name: 红外接收二极管5mm圆头有边; Supplier Part: C7470719; Manufacturer: TONYU(东裕); Supplier Footprint: D=5mm; JLCPCB Part Class: Extended Part; Datasheet: https://atta.szlcsc.com/upload/public/pdf/source/20230726/BF21E4CC1422A1D781F704644E49BB9C.pdf; Supplier: LCSC; DNI: Detector
U25 U26 = ACS722LLCTR-05AB-T: Current Range:5A Current Range:5A Supply Voltage:3V~3.6V Supply Voltage:3V~3.6V Sensitivity:264mV/A Operating Temperature:-40℃~+150℃ Operating Temperature:-40℃~+150℃; Supplier Part: C116613; Manufacturer: ALLEGRO(美国埃戈罗); Supplier Footprint: SOIC-8; JLCPCB Part Class: Extended Part; Datasheet: https://atta.szlcsc.com/upload/public/pdf/source/20170705/1499242733444.pdf; Supplier: LCSC; Current Range: 5A; Supply Voltage: 3V~3.6V; Sensitivity: 264mV/A; Operating Temperature: -40℃~+150℃
U27 U30 = OPA344NA/250: Number of Circuits:单路 Gain Bandwidth Product(GBP):1MHz Current - Input Bias(Ib):0.2pA Slew Rate(SR):0.8V/us Supply Voltage:2.5V~5.5V Supply Voltage:2.5V~5.5V Output Current:15mA Output Type:- Rail to Rail:- Supply Current:150uA Operating Temperature:-40℃~; Supplier Part: C131974; Manufacturer: TI(德州仪器); Supplier Footprint: SOT-23-5; JLCPCB Part Class: Extended Part; Datasheet: https://www.ti.com/cn/lit/gpn/opa344; Supplier: LCSC; Number of Circuits: 单路; Gain Bandwidth Product(GBP): 1MHz; Current - Input Bias(Ib): 0.2pA; Slew Rate(SR): 0.8V/us; Supply Voltage: 2.5V~5.5V; Output Current: 15mA; Supply Current: 150uA; Operating Temperature: -40℃~+85℃
C7-C11 C50 C51 = CL21A106KPFNNNE: Capacitance: Tolerance:±10% Tolerance:±10% Voltage Rated: Temperature Coefficient:; LCSC Part Name: 10uF ±10% 10V; Supplier Part: C17024; Manufacturer: SAMSUNG(三星); Supplier Footprint: 0805; JLCPCB Part Class: Extended Part; Datasheet: https://atta.szlcsc.com/upload/public/pdf/source/20160218/1457707763339.pdf; Supplier: LCSC; Tolerance: ±10%
C74 = CC0603KRX7R9BB103: Capacitance: Tolerance:±10% Tolerance:±10% Voltage Rated: Temperature Coefficient:; LCSC Part Name: 10nF ±10% 50V; Supplier Part: C100042; Manufacturer: YAGEO(国巨); Supplier Footprint: 0603; JLCPCB Part Class: Extended Part; Datasheet: https://atta.szlcsc.com/upload/public/pdf/source/20181008/C309510_22F155564471FAF6A489F7D68F34234E.pdf; Supplier: LCSC; Tolerance: ±10%
D1 = SMAJ20CA_C514090: Reverse Stand-Off Voltage (Vrwm):20V Maximum Clamping Voltage:32.4V Peak Pulse Current (Ipp)@10/1000us:12.3A Breakdown Voltage:22.2V Reverse Leakage Current (Ir):5uA Type:TVS; LCSC Part Name: 双向TVS 20V截止 12.3A峰值脉冲; Supplier Part: C514090; Manufacturer: High Diode(海德); Supplier Footprint: SMA; JLCPCB Part Class: Extended Part; Datasheet: https://atta.szlcsc.com/upload/public/pdf/source/20200416/C514088_CFF28F05FD8C483B94F6F04E6D3574FF.pdf; Supplier: LCSC; Reverse Stand-Off Voltage (Vrwm): 20V; Maximum Clamping Voltage: 32.4V; Peak Pulse Current (Ipp)@10/1000us: 12.3A; Breakdown Voltage: 22.2V; Reverse Leakage Current (Ir): 5uA; Type: TVS
D2 = MMSZ4689: Diode Configuration:Single Zener Voltage (Nom):5.1V Reverse Leakage Current (Ir):10uA@3V Zener Voltage (Range):4.85V~5.36V Zener Voltage (Range):4.85V~5.36V Power Dissipation:350mW Zener Impedance (Zzt):- Tolerance:- Tolerance:-; Supplier Part: C21509; Manufacturer: CJ(江苏长电/长晶); Supplier Footprint: SOD-123; JLCPCB Part Class: Extended Part; Datasheet: https://atta.szlcsc.com/upload/public/pdf/source/20140301/1457707001493.pdf; Supplier: LCSC; Diode Configuration: Single; Zener Voltage (Nom): 5.1V; Reverse Leakage Current (Ir): 10uA@3V; Zener Voltage (Range): 4.85V~5.36V; Power Dissipation: 350mW
F1 F2 = ASMD1812-300: Operating Voltage (Max):8V Current Rating (Max):100A Hold Current:3A Trip Current:5A Power Dissipation:800mW Resistance - Initial (Ri) (Min):12mΩ Resistance - Post Trip (R1) (Max):40mΩ Maximum Time to Trip:4s Operating Temperature:-40℃~+85℃ Operating Temp; LCSC Part Name: 8V 3A 1812自恢复; Supplier Part: C135366; Manufacturer: JDTfuse(集电通); Supplier Footprint: 1812; JLCPCB Part Class: Extended Part; Datasheet: https://atta.szlcsc.com/upload/public/pdf/source/20230515/141EC6E8F2A6D78FC40635A196E31E08.pdf; Supplier: LCSC; Operating Voltage (Max): 8V; Current Rating (Max): 100A; Hold Current: 3A; Trip Current: 5A; Power Dissipation: 800mW; Resistance - Initial (Ri) (Min): 12mΩ; Resistance - Post Trip (R1) (Max): 40mΩ; Maximum Time to Trip: 4s; Operating Temperature: -40℃~+85℃
L1 = CYA0630-1.0UH: Inductance:1uH Tolerance:±20% Tolerance:±20% Rated Current: DC Resistance (DCR):; LCSC Part Name: 1uH ±20%; Supplier Part: C5189744; Manufacturer: SHOU HAN(首韩); Supplier Footprint: SMD,7.2x6.6mm; JLCPCB Part Class: Extended Part; Datasheet: https://atta.szlcsc.com/upload/public/pdf/source/20221010/BB361918FC2293A10D07F0460E6D4CEC.pdf; Supplier: LCSC; Tolerance: ±20%
R68 R69 = RC0603FR-07100KL: Type:Thick Film Resistors Resistance: Tolerance:±1% Tolerance:±1% Power(Watts): Overload Voltage (Max): Temperature Coefficient:±100ppm/℃ Temperature Coefficient:±100ppm/℃ Operating Temperature Range:-55℃~+155℃ Operating Temperature Range:-55℃~+155℃; LCSC Part Name: 厚膜电阻 100kΩ ±1% 100mW; Supplier Part: C14675; Manufacturer: YAGEO(国巨); Supplier Footprint: 0603; JLCPCB Part Class: Extended Part; Datasheet: https://atta.szlcsc.com/upload/public/pdf/source/20140324/1457707028752.pdf; Supplier: LCSC; Type: Thick Film Resistors; Tolerance: ±1%; Temperature Coefficient: ±100ppm/℃; Operating Temperature Range: -55℃~+155℃
R71 = RC0603FR-0756KL: Type:Thick Film Resistors Resistance: Tolerance:±1% Tolerance:±1% Power(Watts): Overload Voltage (Max): Temperature Coefficient:±100ppm/℃ Temperature Coefficient:±100ppm/℃ Operating Temperature Range:-55℃~+155℃ Operating Temperature Range:-55℃~+155℃; LCSC Part Name: 厚膜电阻 56kΩ ±1% 100mW; Supplier Part: C114630; Manufacturer: YAGEO(国巨); Supplier Footprint: 0603; JLCPCB Part Class: Extended Part; Datasheet: https://atta.szlcsc.com/upload/public/pdf/source/20180821/C275644_0D56F95EFF785E7D9A1FEF436B37DA78.pdf; Supplier: LCSC; Type: Thick Film Resistors; Tolerance: ±1%; Temperature Coefficient: ±100ppm/℃; Operating Temperature Range: -55℃~+155℃
R74 R75 = 0603WAF5101T5E: Type:Thick Film Resistors Resistance:5.1kΩ Tolerance:±1% Tolerance:±1% Power(Watts): Overload Voltage (Max): Temperature Coefficient:±100ppm/℃ Temperature Coefficient:±100ppm/℃ Operating Temperature Range:-55℃~+155℃ Operating Temperature Range:-55℃~+155℃; LCSC Part Name: 5.1kΩ ±1% 100mW 厚膜电阻; Supplier Part: C23186; Manufacturer: UNI-ROYAL(厚声); Supplier Footprint: 0603; JLCPCB Part Class: Basic Part; Datasheet: https://atta.szlcsc.com/upload/public/pdf/source/20200306/C422600_1E6D84923E4A46A82E41ADD87F860B5C.pdf; Supplier: LCSC; Type: Thick Film Resistors; Tolerance: ±1%; Temperature Coefficient: ±100ppm/℃; Operating Temperature Range: -55℃~+155℃
SW1 = SS-3235S-L3: Circuit:DPDT Actuator Style:Rectangular columnar Pin Style:SMDSplicing Switch Length:9.1mm Switch Width:3.55mm Switch Height:6.6mm Mounting Style:Brick nogging Actuator Color:Black Current Rating (DC):50mA Voltage Rating (DC):12V Current Rating (AC):50mA; LCSC Part Name: 柄长4mm 立贴双档 滑动开关; Supplier Part: C381098; Manufacturer: XKB Connectivity(中国星坤); Supplier Footprint: SMD; JLCPCB Part Class: Extended Part; Datasheet: https://atta.szlcsc.com/upload/public/pdf/source/20200227/C381098_2A18B7660478ED4C962829E19BCD5514.pdf; Supplier: LCSC; Circuit: DPDT; Actuator Style: Rectangular columnar; Pin Style: SMDSplicing; Switch Length: 9.1mm; Switch Width: 3.55mm; Switch Height: 6.6mm; Mounting Style: Brick nogging; Actuator Color: Black; Current Rating (DC): 50mA; Voltage Rating (DC): 12V; Current Rating (AC): 50mA; Voltage Rating (AC): 12V; Mechanical Life: 1万次; Operating Temperature: -40℃~+85℃
U3 = ETA9740E8A: Supplier Part: C7465512; Manufacturer: ETA(钰泰）; Supplier Footprint: ESOP8; JLCPCB Part Class: Extended Part; Datasheet: https://atta.szlcsc.com/upload/public/pdf/source/20230717/431179BC63C0A80883F19948963E29F3.pdf; Supplier: LCSC
U4 = AON7403_C5310961: Supplier Part: C5310961; Manufacturer: TECH PUBLIC(台舟); Supplier Footprint: PDFN-8; JLCPCB Part Class: Extended Part; Datasheet: https://atta.szlcsc.com/upload/public/pdf/source/20221212/36DA98EDFE73327CB4574501A775E746.pdf; Supplier: LCSC
U6 = LD39050PU33R: Output Type: Maximum Input Voltage:5.5V Output Voltage:3.3V Output Voltage:3.3V MAX Output Current:500mA Power Supply Rejection Ratio (PSRR):65dB Dropout Voltage:400mV@(500mA) standby current:50uA Operating Temperature:-40℃~+125℃ Operating Temperature:-40; LCSC Part Name: 输入5.5V 输出3.3V 500mA; Supplier Part: C132827; Manufacturer: ST(意法半导体); Supplier Footprint: DFN-6(3x3); JLCPCB Part Class: Extended Part; Datasheet: https://atta.szlcsc.com/upload/public/pdf/source/20180516/C222094_E1E2C73C29A988541C4CE5B15C912BE0.pdf; Supplier: LCSC; Maximum Input Voltage: 5.5V; Output Voltage: 3.3V; MAX Output Current: 500mA; Power Supply Rejection Ratio (PSRR): 65dB; Dropout Voltage: 400mV@(500mA); standby current: 50uA; Operating Temperature: -40℃~+125℃; Output Polarity: Positive electrode; Number of Outputs: 1
U31 = SI1304BDL: Supplier Part: C7419947; Manufacturer: TECH PUBLIC(台舟); Supplier Footprint: SOT323; JLCPCB Part Class: Extended Part; Datasheet: https://atta.szlcsc.com/upload/public/pdf/source/20230614/29177D84C02B773E5013B7ECF602DE54.pdf; Supplier: LCSC
USB1 = TYPE-C 16PIN 2MD(073): Connector Type:Type-C Standard:USB 3.1 Gender:Female Mounting Style:Horizontal attachment Number of Contacts:16P Number of Ports:1 Current Rating - Power (Max):5A Operating Temperature Range:-25℃~+85℃ Operating Temperature Range:-25℃~+85℃ Rated Voltage (M; LCSC Part Name: Type-C 母 卧贴; Supplier Part: C2765186; Manufacturer: SHOU HAN(首韩); Supplier Footprint: SMD; JLCPCB Part Class: Extended Part; Datasheet: https://atta.szlcsc.com/upload/public/pdf/source/20211123/39B17C16241EAC15C5E277BDA434118E.pdf; Supplier: LCSC; Connector Type: Type-C; Standard: USB 3.1; Gender: Female; Mounting Style: Horizontal attachment; Number of Contacts: 16P; Number of Ports: 1; Current Rating - Power (Max): 5A; Operating Temperature Range: -25℃~+85℃; Rated Voltage (Max): 5V; Connect-Disconnect Life: 5000 Cuts; Core Colour: Black

## Nets
5V_UP: C7.2 C8.2 C48.2 C49.2 D1.2 F1.2 L2.1 L3.1 U3.7(OUT)
+3V3: C17.2 C43.1 C54.2 C55.2 C56.2 C57.2 C58.2 H1.1 L4.1 L5.2 P1.3 P2.3 R52.2 R53.2 R54.2 U1.1(VBAT) U1.19(VDD) U1.32(VDD) U1.48(VDD) U1.64(VDD) U6.4(VOUT) U10.19(STBY)
+5V: C15.2 C52.2 C53.2 C81.1 C83.1 L6.1 L7.1 R9.2 R82.2 U4.1(S) U4.2(S) U4.3(S) U6.1(EN) U6.6(VIN) U25.8(VCC) U26.8(VCC) U27.5(V+) U30.5(V+)
+5V_MOT: C46.1 C65.2 L6.2 L7.2 U10.13(VM2) U10.14(VM3) U10.24(VM1)
AGND: C46.2 C65.1 L8.2 L9.2 U10.3(PGND1) U10.4(PGND1) U10.9(PGND2) U10.10(PGND2)
GND: C7.1 C8.1 C9.1 C10.1 C11.1 C15.1 C17.1 C43.2 C48.1 C49.1 C50.1 C51.1 C52.1 C53.1 C54.1 C55.1 C56.1 C57.1 C58.1 C66.1 C67.1 C68.1 C74.1 C79.1 C80.1 C81.2 C83.2 C84.1 D1.1 D2.2(A) L8.1 L9.1 LED6.2(K) LED7.2(K) LED8.2(K) LED9.2(K) P1.6 P2.6 P3.6 R55.2 R68.1 R71.1 R74.1 R75.1 SW2.2 SW3.2 SW4.2 U1.12(VSSA/VREF-) U1.18(VSS) U1.30(VCAP_1) U1.31(VSS) U1.47(VSS) U1.63(VSS) U3.8(PGND) U3.9(AGND) U6.2(GND) U6.7(EXP) U10.18(GND) U12.1 U13.1 U14.1 U15.1 U16.1 U17.1 U18.1 U19.1 U20.1 U21.1 U22.1 U23.1 U24.2 U25.5(GND) U26.5(GND) U27.2(V-) U27.3(IN+) U30.2(V-) U30.3(IN+) U31.2(S) USB1.1(GND) USB1.12(GND) USB1.13(SHELL) USB1.14(SHELL)
BOOT_O: R55.1 U1.60(BOOT0)
BTN_02: C67.2 R53.1 R77.1 U1.27(PB1)
BTN_03: C68.2 R54.1 R78.1 U1.28(PB2)
CRS_O1: C76.2 R85.2 U1.24(PC4) U27.1(OUT)
CRS_O2: C82.2 R93.2 U1.25(PC5) U30.1(OUT)
CRS_VIOUT1: R84.2 U25.7(VIOUT)
CRS_VIOUT2: R92.2 U26.7(VIOUT)
ENC_OUT_A1: P1.4 U1.22(PA6)
ENC_OUT_A2: P2.4 U1.41(PA8)
ENC_OUT_B1: P1.5 U1.23(PA7)
ENC_OUT_B2: P2.5 U1.42(PA9)
IR_S_IN1: R49.1 R50.1 U1.59(PB7)
IR_S_IN2: R57.1 R58.1 U1.2(PC13)
IR_S_IN3: R59.1 R60.1 U1.51(PC10)
IR_S_IN4: R61.1 R62.1 U1.52(PC11)
IR_S_IN5: R63.1 R64.1 U1.10(PC2)
IR_S_IN6: R65.1 R66.1 U1.11(PC3)
IR_S_OUT1: R50.2 U1.14(PA0) U13.2
IR_S_OUT2: R58.2 U1.15(PA1) U15.2
IR_S_OUT3: R60.2 U1.20(PA4) U17.2
IR_S_OUT4: R62.2 U1.26(PB0) U19.2
IR_S_OUT5: R64.2 U1.9(PC1) U21.2
IR_S_OUT6: R66.2 U1.8(PC0) U23.2
LED1: R72.1 U3.2(LED1)
LED2: R73.1 U3.3(LED2)
LED3: LED10.2(K) LED11.1(A) LED12.2(K) LED13.1(A) U3.4(LED3)
LIPO+: C50.2 C51.2 F2.1 L1.1 U3.6(BAT)
M_AIN1: U1.43(PA10) U10.21(AIN1)
M_AIN2: U1.40(PC9) U10.22(AIN2)
M_AO1: R88.1 R90.1 U10.1(AO1) U10.2(AO1)
M_AO2: P1.2 U10.5(AO2) U10.6(AO2)
M_BIN1: U1.57(PB5) U10.17(BIN1)
M_BIN2: U1.39(PC8) U10.16(BIN2)
M_BO1: R89.1 R91.1 U10.11(BO1) U10.12(BO1)
M_BO2: P2.2 U10.7(BO2) U10.8(BO2)
M_CURR1_IN: R88.2 U25.1(IP+) U25.2(IP+)
M_CURR1_OUT: U25.3(IP–) U25.4(IP–) U29.1
M_CURR2_IN: R89.2 U26.1(IP+) U26.2(IP+)
M_CURR2_OUT: U26.3(IP–) U26.4(IP–) U29.2
M_PWMA: U1.61(PB8) U10.23(PWMA)
M_PWMB: U1.62(PB9) U10.15(PWMB)
OSC_8M_O1: C80.2 U1.5(PH0-OSC_IN) X3.1(OSC1)
OSC_8M_O2: C79.2 U1.6(PH1-OSC_OUT) X3.2(OSC2)
OSC_O1_STM: U1.3(PC14-OSC32_IN)
OSC_O2_STM: U1.4(PC15-OSC32_OUT)
PA5: H2.1 U1.21(PA5)
PB6: H2.3 U1.58(PB6)
PB10: H2.4 U1.29(PB10)
PB12: H3.1 U1.33(PB12)
PB13: H3.2 U1.34(PB13)
PB14: H3.3 U1.35(PB14)
PB15: H3.4 U1.36(PB15)
PC12: H2.2 U1.53(PC12)
ST_LED1: R46.2 U1.44(PA11)
ST_LED2: R47.2 U1.45(PA12)
ST_LED3: R48.2 U1.54(PD2)
STLINK_JTDI: P3.3 U1.50(PA15)
STLINK_NJTRST: P3.5 U1.56(PB4)
STLINK_NRST: C66.2 H1.4 R52.1 R76.1 U1.7(NRST)
STLINK_RX: H1.3 U1.17(PA3)
STLINK_SWO: P3.4 U1.55(PB3)
STLINK_TCK: P3.2 U1.49(PA14)
STLINK_TMS: P3.1 U1.46(PA13)
STLINK_TX: H1.2 U1.16(PA2)
UART_RX: U1.38(PC7) U11.1
UART_TX: U1.37(PC6) U11.2
$2N727: F1.1 USB1.2(VBUS) USB1.11(VBUS)
$2N1809: L1.2 U3.1(SW)
$2N1982: R71.2 U3.5(ISET)
$2N3514: R51.1 SW1.1
$2N3591: R70.1 SW1.2
$2N3818: C74.2 R68.2 R70.2 U31.1(G)
$2N3895: C9.2 C10.2 C11.2 D2.1(K) L2.2 L3.2 R51.2 R69.2 U4.5(D) U4.6(D) U4.7(D) U4.8(D) U4.9(D)
$2N3927: R69.1 U4.4(G) U31.3(D)
$2N4136: LED11.2(K) LED12.1(A) R72.2
$2N4144: LED10.1(A) LED13.2(K) R73.2
$2N5035: LED6.1(A) R9.1
$2N10613: R74.2 USB1.10(CC2)
$2N10619: R75.2 USB1.4(CC1)
$2N19187: F2.2 U24.1
$3N1651: L4.2 U1.13(VDDA/VREF+)
$3N1929: R77.2 SW2.3
$3N2172: R78.2 SW3.3
$3N2375: R76.2 SW4.3
$3N4904: LED7.1(A) R46.1
$3N4908: LED8.1(A) R47.1
$3N4913: LED9.1(A) R48.1
$3N7852: C84.2 L5.1 U10.20(VCC)
$3N11524: P2.1 R91.2
$3N11535: P1.1 R90.2
$7N410: R49.2 U12.2
$7N824: R57.2 U14.2
$7N1016: R59.2 U16.2
$7N1208: R61.2 U18.2
$7N1400: R63.2 U20.2
$7N1592: R65.2 U22.2
$7N3107: R82.1 U25.6(BW_SEL) U26.6(BW_SEL)
$7N4059: C76.1 R84.1 R85.1 U27.4(IN-)
$7N6586: C82.1 R92.1 R93.1 U30.4(IN-)

Not connected (* = marked no-connect by the designer): SW1 3* 4* 5* 6*; SW2 1* 4*; SW3 1* 4*; SW4 1* 4*; U6 3(PG)* 5(NC)*; USB1 3(SBU2)* 5(DN2)* 6(DP1)* 7(DN1)* 8(DP2)* 9(SBU1)*

## Notes on the sheets
sheet 1
- IR-SENSOR3
- IR-SENSOR4
- IR-SENSOR2
- IR-SENSOR5
- IR-SENSOR1
- STM32F446RE
- IR-SENSOR6
- MotorController
  LEFT
- MotorController
  RIGHT
- Encoder
  LEFT
- Encoder
  RIGHT
- Motor
  LEFT
- Motor
  RIGHT
sheet 3
- V_CAP bend pin
  DO NOT CONNECT TO GROUND
